# Altium schematic sheet Servo.SchDoc
size A
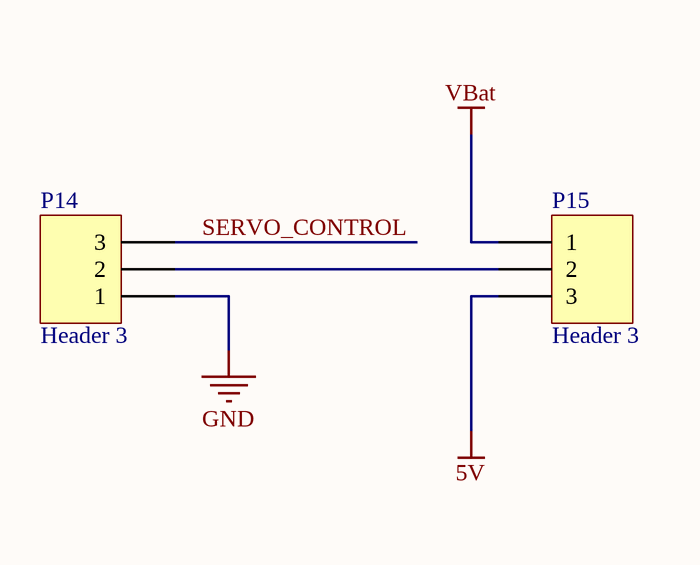
[diagram p0: Servo.SchDoc]

## Parts
P14  Header 3  [HDR1X3]
P15  Header 3  [HDR1X3]

## Nets
5V: P15.3
GND: P14.1
VBat: P15.1
SERVO_CONTROL: P14.3
NetP14_2: P14.2 P15.2

## Library data of the parts
P14 P15 = Header 3: Header, 3-Pin; LatestRevisionDate: 17-Jul-2002; LatestRevisionNote: Re-released for DXP Platform.; Publisher: Altium Limited